# EAGLE design Qwiic_Button (EAGLE 9.5.2)
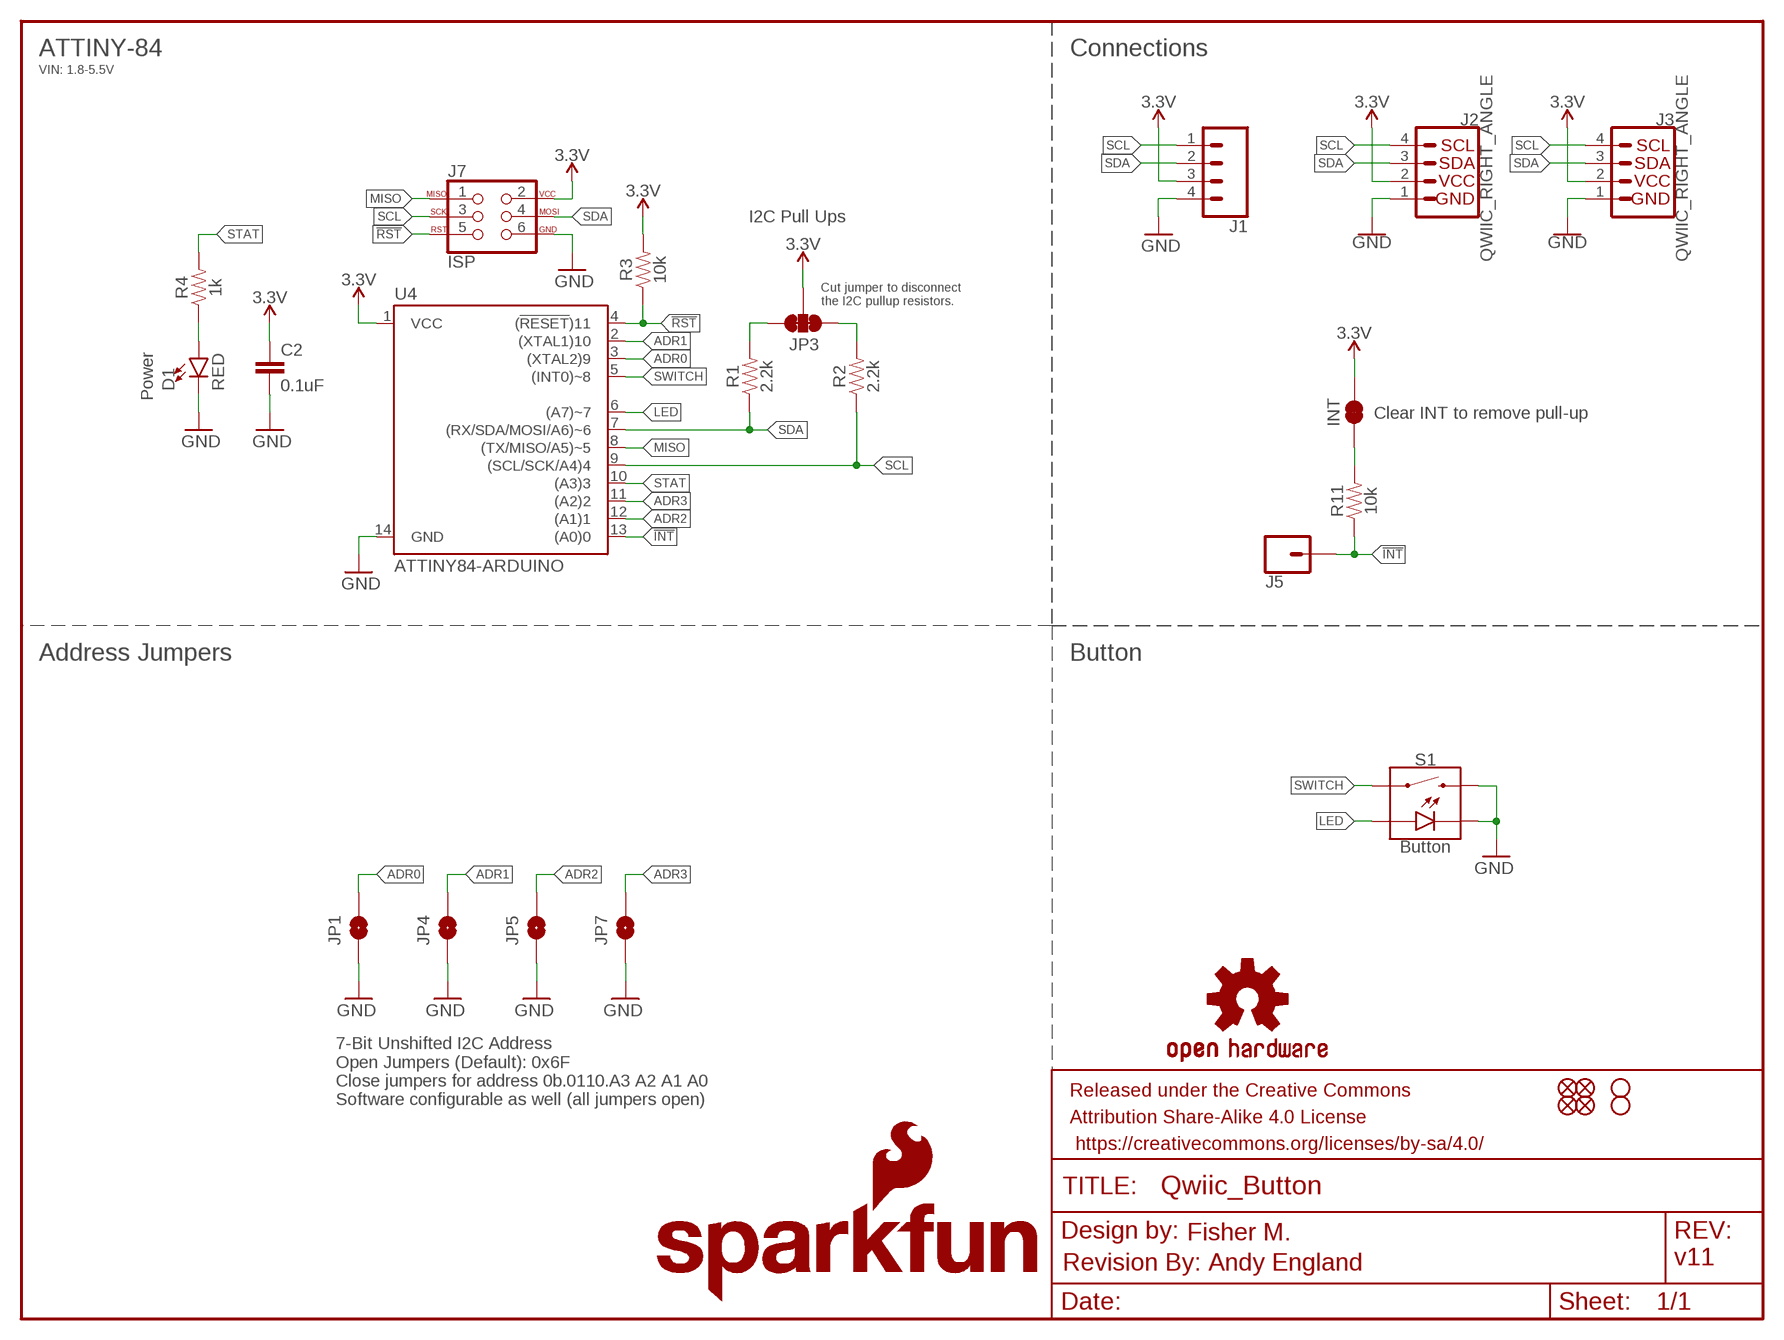
[diagram p0: schematic, sheet 1]

## Parts
C2  0.1uF  0.1UF-0603-25V-(+80/-20%)  [0603]
D1  RED  LED-RED0603  [LED-0603]
FRAME1  FRAME-LETTER  [CREATIVE_COMMONS]
H1  STAND-OFF  [STAND-OFF]
H2  STAND-OFF  [STAND-OFF]
INT  JUMPER-SMT_2_NC_TRACE_SILK  [SMT-JUMPER_2_NC_TRACE_SILK]
J1  CONN_041X04_NO_SILK  [1X04_NO_SILK]
J2  QWIIC_RIGHT_ANGLE  QWIIC_CONNECTORJS-1MM  [JST04_1MM_RA]
J3  QWIIC_RIGHT_ANGLE  QWIIC_CONNECTORJS-1MM  [JST04_1MM_RA]
J5  CONN_01PTH_NO_SILK_YES_STOP  [1X01_NO_SILK]
J7  ISP  AVR_SPI_PROG_3X2TESTPOINTS  [2X3_TEST_POINTS]
JP1  JUMPER-SMT_2_NO_NO-SILK  [SMT-JUMPER_2_NO_NO-SILK]
JP2  FIDUCIALUFIDUCIAL  [MICRO-FIDUCIAL]
JP3  JUMPER-SMT_3_2-NC_TRACE_SILK  [SMT-JUMPER_3_2-NC_TRACE_SILK]
JP4  JUMPER-SMT_2_NO_NO-SILK  [SMT-JUMPER_2_NO_NO-SILK]
JP5  JUMPER-SMT_2_NO_NO-SILK  [SMT-JUMPER_2_NO_NO-SILK]
JP6  FIDUCIALUFIDUCIAL  [MICRO-FIDUCIAL]
JP7  JUMPER-SMT_2_NO_NO-SILK  [SMT-JUMPER_2_NO_NO-SILK]
JP8  FIDUCIALUFIDUCIAL  [MICRO-FIDUCIAL]
JP9  FIDUCIALUFIDUCIAL  [MICRO-FIDUCIAL]
LOGO1  OSHW-LOGOMINI  [OSHW-LOGO-MINI]
LOGO2  REVISION  [REVISION]
LOGO3  SFE_LOGO_NAME.1_INCH  [SFE_LOGO_NAME_.1]
LOGO4  SFE_LOGO_FLAME.1_INCH  [SFE_LOGO_FLAME_.1]
R1  2.2k  2.2KOHM-0603-1/10W-1%  [0603]
R2  2.2k  2.2KOHM-0603-1/10W-1%  [0603]
R3  10k  10KOHM-0603-1/10W-1%  [0603]
R4  1k  1KOHM-0603-1/10W-1%  [0603]
R11  10k  10KOHM-0603-1/10W-1%  [0603]
S1  Button  MOMENTARY-SWITCH-SPST-LED-PTH-12MM  [TACTILE_SWITCH_LED_PTH_12MM]
U4  ATTINY84-ARDUINO  [SO14]

## Nets
3.3V: C2.1 INT.2 J1.3 J2.2 J3.2 J7.2 JP3.2 R3.2 U4.1(VCC)
!INT: J5.1 R11.1 U4.13((A0)0)
!RST: J7.5 R3.1 U4.4((!RESET!)11)
ADR0: JP1.2 U4.3((XTAL2)9)
ADR1: JP4.2 U4.2((XTAL1)10)
ADR2: JP5.2 U4.12((A1)1)
ADR3: JP7.2 U4.11((A2)2)
GND: C2.2 D1.C J1.4 J2.1 J3.1 J7.6 JP1.1 JP4.1 JP5.1 JP7.1 S1.2 S1.C U4.14(GND)
INT_R: INT.1 R11.2
LED: S1.A U4.6((A7)~7)
MISO: J7.1 U4.8((TX/MISO/A5)~5)
N$3: D1.A R4.1
SCL: J1.1 J2.4 J3.4 J7.3 R2.1 U4.9((SCL/SCK/A4)4)
SCL_PU1: JP3.1 R2.2
SDA: J1.2 J2.3 J3.3 J7.4 R1.1 U4.7((RX/SDA/MOSI/A6)~6)
SDA_PU1: JP3.3 R1.2
STAT: R4.2 U4.10((A3)3)
SWITCH: S1.4 U4.5((INT0)~8)

## Notes on the sheet
- ATTINY-84 | Connections
- VIN: 1.8-5.5V
- I2C Pull Ups
- Cut jumper to disconnect
  the I2C pullup resistors.
- Power
- Clear INT to remove pull-up
- Address Jumpers | Button
- 7-Bit Unshifted I2C Address
  Open Jumpers (Default): 0x6F
  Close jumpers for address 0b.0110.A3 A2 A1 A0
  Software configurable as well (all jumpers open)
- Fisher M.
- Andy England | v11

## Library data of the parts
C2 = SparkFun-Capacitors:0.1UF: 0.1µF ceramic capacitors A capacitor is a passive two-terminal electrical component used to store electrical energy temporarily in an electric field.; PROD_ID: CAP-00810
D1 = SparkFun-LED:LED-RED: Red SMD LED Used in manufacturing of most products at SparkFun Packages: 0603 - SMD 0603 package [Product Link] <http://docs.avagotech.com/docs/AV02-0551EN> 0603 SMART - SMD 0603 SMART package ( more efficient and expensive)[Product Link] <http://www.osram-os.com/Graphics/XPic2/00077099_0.pdf> 1206 - SMD1206 package [Product Link] <https://www.sparkfun.com/datasheets/DevTools/LilyPad/Q150OVS4.pdff> SparkFun Products: Pro Mini 328 -5V <https://www.sparkfun.com/products/821> RedBoard <https://www.sparkfun.com/products/12757> IOIO-OTG <https://www.sparkfun.com/products/13613>; PROD_ID: DIO-00819
FRAME1 = SparkFun-Aesthetics:FRAME-LETTER: Schematic Frame - Letter Standard 8.5x11 US Letter frame
H1 H2 = SparkFun-Hardware:STAND-OFF: Stand Off Drill holes for mechanically mounting via screws, standoffs, etc. Note: Use the keepout ring to avoid running the screw head into surrounding components. Variant Overviews STAND-OFF - Mechanical footprint for a #4 phillips button head screw. STAND-OFF-TIGHT - Mechanical footprint for a #4 phillips button head screw, Example SparkFun Products Screw - Phillips Head (1/4", 4-40, 10 pack) <https://www.sparkfun.com/products/10453> (PRT-10453) Screw - Phillips Head (1/2", 4-40, 10 pack) <https://www.sparkfun.com/products/10452> (PRT-10452) Screw - Phillips Head (3/4", 4-40, 10 pack) <https://www.sparkfun.com/products/10451> (PRT-10451) Screw - Phillips Head (1", 4-40, 10 pack) <https://www.sparkfun.com/products/10450> (PRT-10450)
INT = SparkFun-Jumpers:JUMPER-SMT_2_NC_TRACE: Normally closed trace jumper This jumper has a trace between two pads so it's normally closed (NC). Use a razor knife to open the connection. For best results follow the IPC guidelines for cutting traces: Cutout at least 0.063 mm (0.005 in). Remove all loose material to clean up the cut area. Seal the cut with an approved epoxy. Reapply solder to reclose the connection.
J1 = SparkFun-Connectors:CONN_04: Multi connection point. Often used as Generic Header-pin footprint for 0.1 inch spaced/style header connections On any of the 0.1 inch spaced packages, you can populate with these: Break Away Headers - Straight <https://www.sparkfun.com/products/116> (PRT-00116) Break Away Male Headers - Right Angle <https://www.sparkfun.com/products/553> (PRT-00553) Female Headers <https://www.sparkfun.com/products/115> (PRT-00115) Break Away Headers - Machine Pin <https://www.sparkfun.com/products/117> (PRT-00117) Break Away Female Headers - Swiss Machine Pin <https://www.sparkfun.com/products/743> (PRT-00743) For SCREWTERMINALS and SPRING TERMINALS visit here: Screw Terimnals on SparkFun.com <https://www.sparkfun.com/search/results?term=Screw+Terminals> (5mm/3.5mm/2.54mm spacing) This device is also useful as a general connection point to wire up your design to another part of your project. Our various solder wires solder well into these plated through hole pads. Hook-Up Wire - Assortment (Stranded, 22 AWG) <https://www.sparkfun.com/products/11375> (PRT-11375) Hook-Up Wire - Assortment (Solid Core, 22 AWG) <https://www.sparkfun.com/products/11367> (PRT-11367) View the entire wire category on our website here <https://www.sparkfun.com/categories/141> Special notes: Molex polarized connector foot print use with SKU : PRT-08231 with associated crimp pins and housings. 1MM SMD Version SKU: PRT-10208; PROD_ID: CONN-09696
J2 J3 = SparkFun-Connectors:QWIIC_CONNECTOR: SparkFun I2C Standard Qwiic Connector An SMD 1mm pitch JST connector makes it easy and quick (get it? Qwiic?) to connect I2C devices to each other. The Qwiic system <http://www.sparkfun.com/qwiic> enables fast and solderless connection between popular platforms and various sensors and actuators. We carry 200mm <https://www.sparkfun.com/products/14204>, 100mm <https://www.sparkfun.com/products/14205>, 50mm <https://www.sparkfun.com/products/14206>, and breadboard friendly <https://www.sparkfun.com/products/14207> Qwiic cables. We also offer 10 pcs strips <https://www.sparkfun.com/products/14323> the SMD connectors.; PROD_ID: CONN-13694
J5 = SparkFun-Connectors:CONN_01: Single connection point. Often used as Generic Header-pin footprint for 0.1 inch spaced/style header connections On any of the 0.1 inch spaced packages, you can populate with these: Break Away Headers - Straight <https://www.sparkfun.com/products/116> (PRT-00116) Break Away Male Headers - Right Angle <https://www.sparkfun.com/products/553> (PRT-00553) Female Headers <https://www.sparkfun.com/products/115> (PRT-00115) Break Away Headers - Machine Pin <https://www.sparkfun.com/products/117> (PRT-00117) Break Away Female Headers - Swiss Machine Pin <https://www.sparkfun.com/products/743> (PRT-00743) This device is also useful as a general connection point to wire up your design to another part of your project. Our various solder wires solder well into these plated through hole pads. Hook-Up Wire - Assortment (Stranded, 22 AWG) <https://www.sparkfun.com/products/11375> (PRT-11375) Hook-Up Wire - Assortment (Solid Core, 22 AWG) <https://www.sparkfun.com/products/11367> (PRT-11367) View the entire wire category on our website here <https://www.sparkfun.com/categories/141> Special notes: SMTSO-256-ET is a "flush mount" nut for a 4-40 screw. We mostly use this on specialty testbeds; it is a nice way to connect hardware to your PCB at an adjustable hieght. Also note, the SNAP packages are for using a snappable style connector. We sell a baggie of snaps and they are also used on two LilyPad designs: Snap Assortment - 30 pack (male and female) <https://www.sparkfun.com/products/11347> (DEV-11347) LilyPad Arduino SimpleSnap <https://www.sparkfun.com/products/10941> (DEV-10941) LilyPad SimpleSnap Protoboard <https://www.sparkfun.com/products/10940> (DEV-10940)
J7 = SparkFun-Connectors:AVR_SPI_PROG_3X2: AVR ISP 6 Pin This is the reduced ISP connector for AVR programming. Common on Arduino. This footprint will take up less PCB space and can be used with a 10-pin to 6-pin adapter such as SKU: BOB-08508 **Special note about "TEST_POINT" package. The stop mask is on the top side, so if you want your programming test points to be on the bottom of your board, make sure to place this package on the bottom side of the board. This also ensure that the orientation to program from the bottom side will be correct. SparkFun Products: SparkFun ISP Pogo Adapter <https://www.sparkfun.com/products/11591> - NS Tiny AVR Programmer <https://www.sparkfun.com/products/11801> -PTH
JP1 JP4 JP5 JP7 = SparkFun-Jumpers:JUMPER-SMT_2_NO: Normally open jumper This jumper has two pads in close proximity to each other. Apply solder to close the connection. Round pads are easier to solder for beginners, but are a lot larger. SparkFun Product that uses the round pads: SparkFun EL Sequencer <https://www.sparkfun.com/products/12781>
JP2 JP6 JP8 JP9 = SparkFun:FIDUCIAL: Fiducial Alignment Points Various fiducial points for machine vision alignment.
JP3 = SparkFun-Jumpers:JUMPER-SMT_3_2-NC_TRACE: Normally closed trace jumper (2 of 2 connections) This jumper has a trace between all three pads so they are normally closed (NC). Use a razor knife to open the connection(s). For best results follow the IPC guidelines for cutting traces: Cutout at least 0.063 mm (0.005 in). Remove all loose material to clean up the cut area. Seal the cut with an approved epoxy. Reapply solder to reclose the connection(s).
LOGO1 = SparkFun-Aesthetics:OSHW-LOGO: Open-Source Hardware (OSHW) Logo This logo indicates the piece of hardware it is found on incorporates a OSHW license and/or adheres to the definition of open source hardware found here: http://freedomdefined.org/OSHW
LOGO2 = SparkFun-Aesthetics:REVISION: "Revision By" Text Preceding text for revisor documentation. Includes schematic text on "symbols" layer, and board text on tDoc.
LOGO3 = SparkFun-Aesthetics:SFE_LOGO_NAME: SparkFun Font Logo This is the SparkFun name logo. The logo on the schematic will always be the same size; the package variant is the height of the flame part of the logo (or the height the flame would be, if it were drawn). Default layer for the logo on the board is tSilk.
LOGO4 = SparkFun-Aesthetics:SFE_LOGO_FLAME: SparkFun Flame Logo This is the SparkFun flame logo. The logo on the schematic will always be the same size; the package variant is the height of the flame. Default layer for the logo on the board is tSilk.
R1 R2 = SparkFun-Resistors:2.2KOHM: 2.2kΩ resistor A resistor is a passive two-terminal electrical component that implements electrical resistance as a circuit element. Resistors act to reduce current flow, and, at the same time, act to lower voltage levels within circuits. - Wikipedia; PROD_ID: RES-08272
R3 R11 = SparkFun-Resistors:10KOHM: 10kΩ resistor A resistor is a passive two-terminal electrical component that implements electrical resistance as a circuit element. Resistors act to reduce current flow, and, at the same time, act to lower voltage levels within circuits. - Wikipedia; PROD_ID: RES-00824
R4 = SparkFun-Resistors:1KOHM: 1kΩ resistor A resistor is a passive two-terminal electrical component that implements electrical resistance as a circuit element. Resistors act to reduce current flow, and, at the same time, act to lower voltage levels within circuits. - Wikipedia; PROD_ID: RES-07856
S1 = SparkFun-Switches:MOMENTARY-SWITCH-SPST-LED: Momentary Switch (Pushbutton) - SPST - w/ LED Normally-open (NO) SPST momentary switches (buttons, pushbuttons), with a built-in LED. Variants PTH-CHERRY - Cherry MX Switch Cherry MX Keyswitches are top-of-the-line mechanical keyboard switches. They’re satisfyingly “clicky”, reliable up to tens-of-millions of key presses, and a standard in gaming and programming keyboards across the globe. This ‘blue’ version Cherry MX Switch is favored by most due to its secondary internal actuator making it less likely to “double-tap.” If you are looking for a noticeably audible and high-quality key switch, this is the perfect option for you! Cherry MX Switch <https://www.sparkfun.com/products/13834> (COM-13834) Cherry MX Switch Breakout <https://www.sparkfun.com/products/13773> (BOB-13773) PTH-12MM and PTH-12MM-KIT - 12mm Illuminated LED KIT variant is for soldering kits. There is no tStop (covering up the top side of the pads with mask). This helps the beginner see which side they should be soldering too. LED Tactile Button Breakout <https://www.sparkfun.com/products/10467> (BOB-10467) LED Tactile Button - Red <https://www.sparkfun.com/products/10442> (COM-10442) LED Tactile Button - Blue <https://www.sparkfun.com/products/10443> (COM-10443) LED Tactile Button - Green <https://www.sparkfun.com/products/10440> (COM-10440) LED Tactile Button - Orange <https://www.sparkfun.com/products/10441> (COM-10441) LED Tactile Button - White <https://www.sparkfun.com/products/10439> (COM-10439); PROD_ID: SWCH-11758; SF_SKU: COM-10442
U4 = SparkFun-IC-Microcontroller:ATTINY84-ARDUINO; PROD_ID: IC-14155

## Board
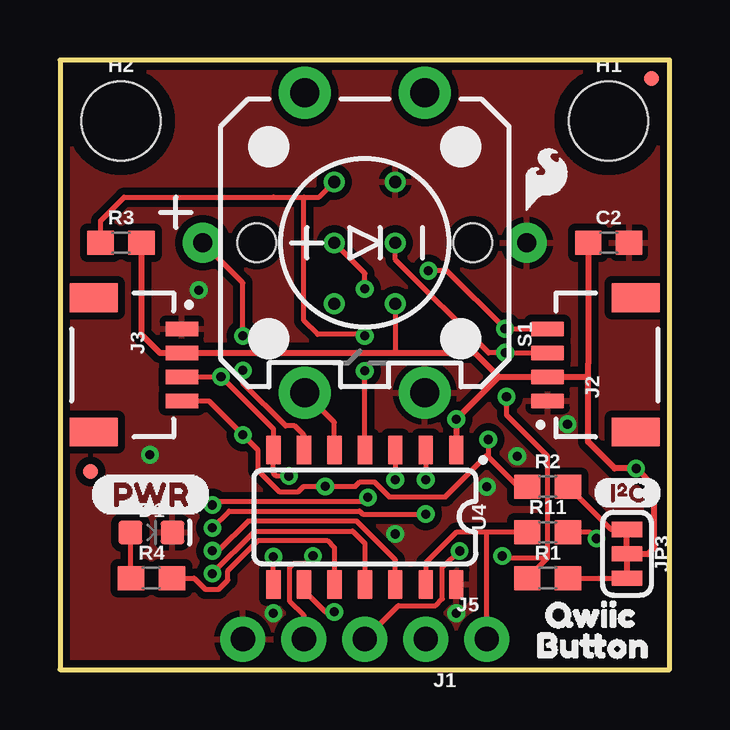
[diagram p1: board, top side]
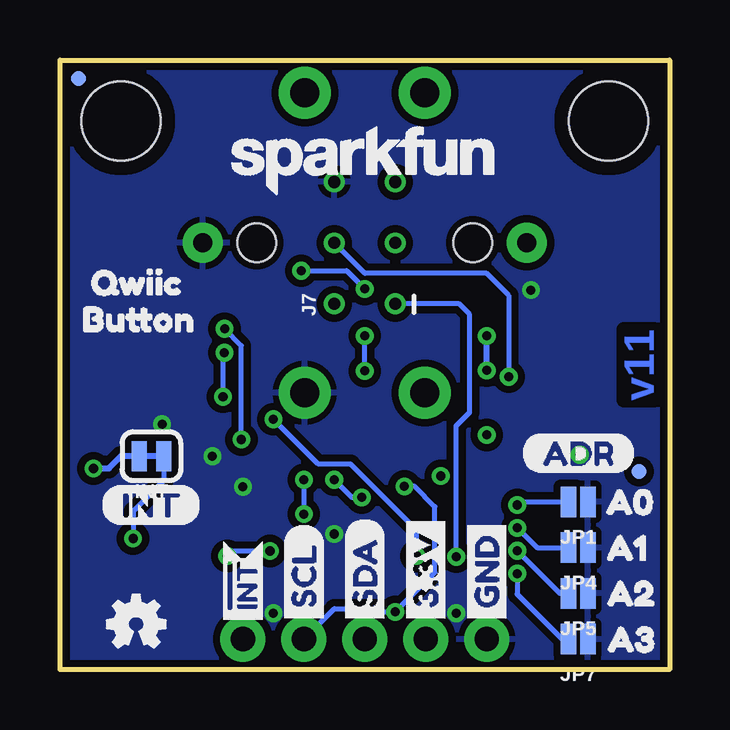
[diagram p2: board, bottom side, seen from below]

Size 25.4 x 25.4 mm. Coordinates in mm from the lower left corner, seen from the top.
Outline: 0,0 25.4,0 25.4,25.4 0,25.4 0,0
Copper layers (1*16): Top 0.035mm / dielectric 1.5mm / Bottom 0.035mm
Design rules "SparkFun-2-layer-TIGHT": minimum track width 7mil, minimum drill 15mil, track to track 7mil, track to pad 7mil, pad to pad 7mil, via to via 7mil, smd to smd 7mil, copper to edge 7mil, drill to drill 7mil, minimum pad ring 7mil, minimum via ring 7mil, stop-mask expansion 4mil, vias tented up to drill 25mil, thermal gap 10mil

### Footprints (pad centres in the part's own frame; a part is rotated, then mirrored left to right if it is on the bottom)
0603 = smd 1.1 x 1: 1 -0.85,0; 2 0.85,0
LED-0603 = smd 1 x 1: A -0.877,0; C 0.877,0
STAND-OFF = hole 3.302: 0,0
SMT-JUMPER_2_NC_TRACE_SILK = smd 0.635 x 1.27: 1 -0.508,0; 2 0.508,0
1X04_NO_SILK = drill 1.016 pad 1.88: 1 0,0; 2 2.54,0; 3 5.08,0; 4 7.62,0
JST04_1MM_RA = smd 0.6 x 1.35: 1 -1.5,0; 2 -0.5,0; 3 0.5,0; 4 1.5,0 | smd 1.2 x 2: NC1 2.8,-3.675; NC2 -2.8,-3.675
1X01_NO_SILK = drill 1.016 pad 1.88: 1 0,0
2X3_TEST_POINTS = drill 0.508: 1 -2.54,-1.27; 2 -2.54,1.27; 3 0,-1.27; 4 0,1.27; 5 2.54,-1.27; 6 2.54,1.27
SMT-JUMPER_2_NO_NO-SILK = smd 0.635 x 1.27: 1 -0.406,0; 2 0.406,0
MICRO-FIDUCIAL = smd 0.635 x 0.635: 1 0,0
SMT-JUMPER_3_2-NC_TRACE_SILK = smd 0.635 x 1.27: 1 -1.016,0; 2 0,0; 3 1.016,0
TACTILE_SWITCH_LED_PTH_12MM = drill 1.2 pad 2.159: 1 -6.25,2.5; 2 6.25,2.5; 3 -6.25,-2.5; 4 6.25,-2.5 | drill 0.8 pad 1.676: A 0,-6.75; C 0,6.75 | hole 1.6: 0,4.5; 0,-4.5
SO14 = smd 0.6 x 1.2: 1 -3.81,-2.8; 2 -2.54,-2.8; 3 -1.27,-2.8; 4 0,-2.8; 5 1.27,-2.8; 6 2.54,-2.8; 7 3.81,-2.8; 8 3.81,2.8; 9 2.54,2.8; 10 1.27,2.8; 11 0,2.8; 12 -1.27,2.8; 13 -2.54,2.8; 14 -3.81,2.8

### Placement (x,y rotation side)
C2  22.86,17.78 0 top
D1  3.81,5.71 0 top
FRAME1  -19.05,-8.89 0 top  (outside the outline)
H1  22.86,22.86 0 top
H2  2.54,22.86 0 top
INT  21.59,8.89 180 bottom
J1  15.24,1.27 180 top
J2  20.32,12.7 90 top
J3  5.08,12.7 270 top
J5  17.78,1.27 0 top
J7  12.7,17.78 90 bottom
JP1  3.81,6.99 180 bottom
JP2  24.64,24.64 0 bottom
JP3  23.62,4.83 270 top
JP4  3.81,5.08 180 bottom
JP5  3.81,3.17 180 bottom
JP6  1.27,8.26 0 bottom
JP7  3.81,1.27 180 bottom
JP8  1.27,8.26 0 top
JP9  24.64,24.64 0 top
LOGO1  22.23,1.91 0 bottom
LOGO2  -7.62,-11.43 0 top  (outside the outline)
LOGO3  12.76,21.21 0 bottom
LOGO4  20.26,20.45 0 top
R1  20.32,3.81 0 top
R2  20.32,7.62 0 top
R3  2.54,17.78 0 top
R4  3.81,3.81 0 top
R11  20.32,5.71 0 top
S1  12.7,17.78 270 top
U4  12.7,6.35 180 top
U$1  [BUTTON1]  18.92,1.02 0 top
U$2  [BUTTON1]  25.4,14.61 0 bottom
U$3  [PWR-()-04]  1.27,7.3 0 top
U$4  [INT-()-04]  23.75,6.86 0 bottom
U$5  [SCL]  15.24,1.65 90 bottom
U$6  [SDA]  12.7,1.65 90 bottom
U$7  [3.3V]  10.16,1.65 90 bottom
U$8  [GND]  7.62,1.65 90 bottom
U$9  [(ADR)]  6.22,9.02 0 bottom
U$10  [I_SUPER2_C-()-03]  22.23,7.37 0 top
U$15  [INT#-[<-04]  17.78,1.4 90 bottom
U$16  [A00]  3.56,6.99 0 bottom
U$17  [A11]  3.68,5.08 0 bottom
U$19  [A22]  3.68,3.17 0 bottom
U$20  [QWIIC0]  25.02,16.13 0 bottom
U$21  [A33]  3.49,1.27 0 bottom
U$23  [QWIIC0]  19.3,2.29 0 top

### Tracks (layer width: path | path; a pad name or v marks a point on that pad's centre or on a via)
3.3V  (via drill 0.38)
  Top 0.203: J1.3 10.16,2.25 9.58,2.83 9.58,4.27 9.74,4.43 10.23,4.43 v10.54,4.74 | J7.2 13.97,13.2
  Top 0.254: R3.2 3.39,13.97 4.16,13.2 J3.2 13.97,13.2 17.28,13.2 18.28,12.2 | C2.1 22.01,12.74 22.01,12.19 | 18.28,12.2 J2.2 22,12.2 22.01,12.19 | 18.28,12.2 v16.51,10.43 U4.1 | JP3.2 24.51,4.83 24.77,5.08 24.77,7.62 v24,8.38 23.11,8.38 22.01,9.49 22.01,12.19
  Bottom 0.203: v16.51,10.43 14.64,8.56 13.29,8.56 10.54,5.8 v10.54,4.74
  Bottom 0.254: v24,8.38 23.37,8.38 22.86,8.89 INT.2
!INT
  Top 0.203: U4.13 15.24,4.45 16.51,5.71 17.78,5.71 | R11.1 19.05,5.71 17.78,5.71 | J5.1 17.78,5.71
!RST  (via drill 0.38)
  Top 0.203: R3.1 1.69,18.71 2.67,19.68 8.89,19.68 10.16,19.68 | U4.4 v12.7,12.45 | 10.16,19.68 10.79,19.68 J7.5 | v12.7,13.91 12.64,13.97 10.73,13.97 10.16,14.54 10.16,19.68
  Bottom 0.203: v12.7,12.45 v12.7,13.91
ADR0  (via drill 0.38)
  Top 0.203: U4.3 v13.97,7.91 | v12.83,7.18 12.64,6.99 6.48,6.99 v6.35,6.86
  Bottom 0.203: v12.83,7.18 13.23,7.18 v13.97,7.91 | v6.35,6.86 6.22,6.99 JP1.2
ADR1  (via drill 0.38)
  Top 0.203: U4.2 v15.24,7.91 | v6.35,5.91 7.05,6.6 12.48,6.6 12.61,6.48 v15.24,6.48
  Bottom 0.203: v15.24,7.91 v15.24,6.48 | v6.35,5.91 5.52,5.08 JP4.2
ADR2  (via drill 0.38)
  Top 0.203: U4.12 13.97,4.57 12.36,6.18 7.84,6.18 6.6,4.95 v6.35,4.95
  Bottom 0.203: v6.35,4.95 4.57,3.17 JP5.2
ADR3  (via drill 0.38)
  Top 0.203: U4.11 12.7,5.26 12.19,5.77 8.11,5.77 v6.35,4.01 v6.35,4
  Bottom 0.203: v6.35,4 6.35,3.15 4.47,1.27 JP7.2
GND  (via drill 0.38)
  other vias: 21.15,10.22 19.05,8.89 17.78,7.62 13.97,5.65 3.75,8.95 5.78,15.81 16.51,2.35 8.89,2.35
  pour Top (isolate 0.305): 0,0 0,25.4 25.4,25.4 25.4,0
  pour Bottom (isolate 0.305): 0,0 25.4,0 25.4,25.4 0,25.4
INT_R  (via drill 0.38)
  Top 0.203: R11.2 22.1,5.71 v22.35,5.46
  Bottom 0.203: v22.35,5.46 22.35,6.6 21.08,7.87 INT.1
LED  (via drill 0.38)
  Top 0.203: U4.6 10.16,9.78 9.78,10.16 9.4,10.16 7.62,11.94 v7.62,12.47 | v7.62,13.91 7.62,16.11 S1.A
  Bottom 0.254: v7.62,12.47 v7.62,13.91
MISO  (via drill 0.38)
  Top 0.203: U4.8 v8.89,4.7
  Bottom 0.203: v8.89,4.7 8.89,10.16 8.33,10.72 8.33,14.8 8.76,15.24 J7.1
N$3
  Top 0.203: D1.A 2.93,3.84 R4.1
SCL  (via drill 0.38)
  Top 0.203: J2.4 v18.54,14.2 16.12,16.62 v15.35,16.62 | v17.84,9.59 17.84,8.87 | J3.4 6.2,11.2 v7.62,9.78 8.23,9.16 8.23,8.31 8.91,7.64 | 17.84,8.87 19.09,7.62 R2.1 | 9.13,7.42 8.91,7.64 | 17.84,8.87 17.78,8.93 16.05,7.2 13.72,7.2 13.1,7.82 12.49,7.82 12.3,7.63 v11.05,7.63 10.15,7.63 9.93,7.42 9.13,7.42 | v11.43,2.4 11.06,2.4 10.16,3.3 | v12.7,15.86 12.7,16.51 J7.3 | 8.91,7.64 9.13,7.42
  Top 0.254: 10.16,3.3 U4.9
  Bottom 0.203: v17.84,9.59 17.84,13.5 v18.54,14.2 | J1.1 13.97,2.54 12.05,2.54 11.92,2.4 v11.43,2.4 9.78,4.05 9.78,6.79 10.62,7.63 v11.05,7.63 | v15.35,16.62 13.46,16.62 v12.7,15.86
SCL_PU1
  Top 0.203: JP3.1 22.95,5.84 R2.2
SDA  (via drill 0.38)
  Top 0.203: J2.3 v18.55,13.2 17.86,13.2 13.97,17.09 J7.4 | J3.3 v6.71,12.2 6.72,12.2 8.89,10.03 U4.7 8.89,8.19 9.02,8.06 v9.54,8.06 | R1.1 20.32,4.66 | 20.32,4.66 20.32,8.89 18.61,10.6 v18.61,11.37 | J1.2 14.1,2.67 15.66,2.67 15.93,2.94 15.93,4.27 15.99,4.33 16.6,4.94 v16.65,4.94 | v18.43,4.73 18.5,4.66 20.32,4.66
  Bottom 0.203: v18.61,11.37 18.61,13.14 v18.55,13.2 | v6.71,12.2 6.71,15.6 7.62,16.51 12.7,16.51 J7.4 | v16.65,4.94 18.22,4.94 v18.43,4.73
SDA_PU1
  Top 0.203: R1.2 23.22,3.81 | 23.22,3.81 JP3.3 24.13,3.81 23.22,3.81
STAT
  Top 0.203: R4.2 5.59,3.81 6.04,3.35 6.62,3.35 7,3.73 7,4.11 8.27,5.38 11.12,5.38 11.43,5.08 U4.10
SWITCH
  Top 0.203: U4.5 11.43,10.3 S1.4

### Text on the board
Bottom: v11
Measures: Units in Inches
tDocu: Fisher M. | Andy England